# EAGLE schematic pcbremote (EAGLE 9.6.2)
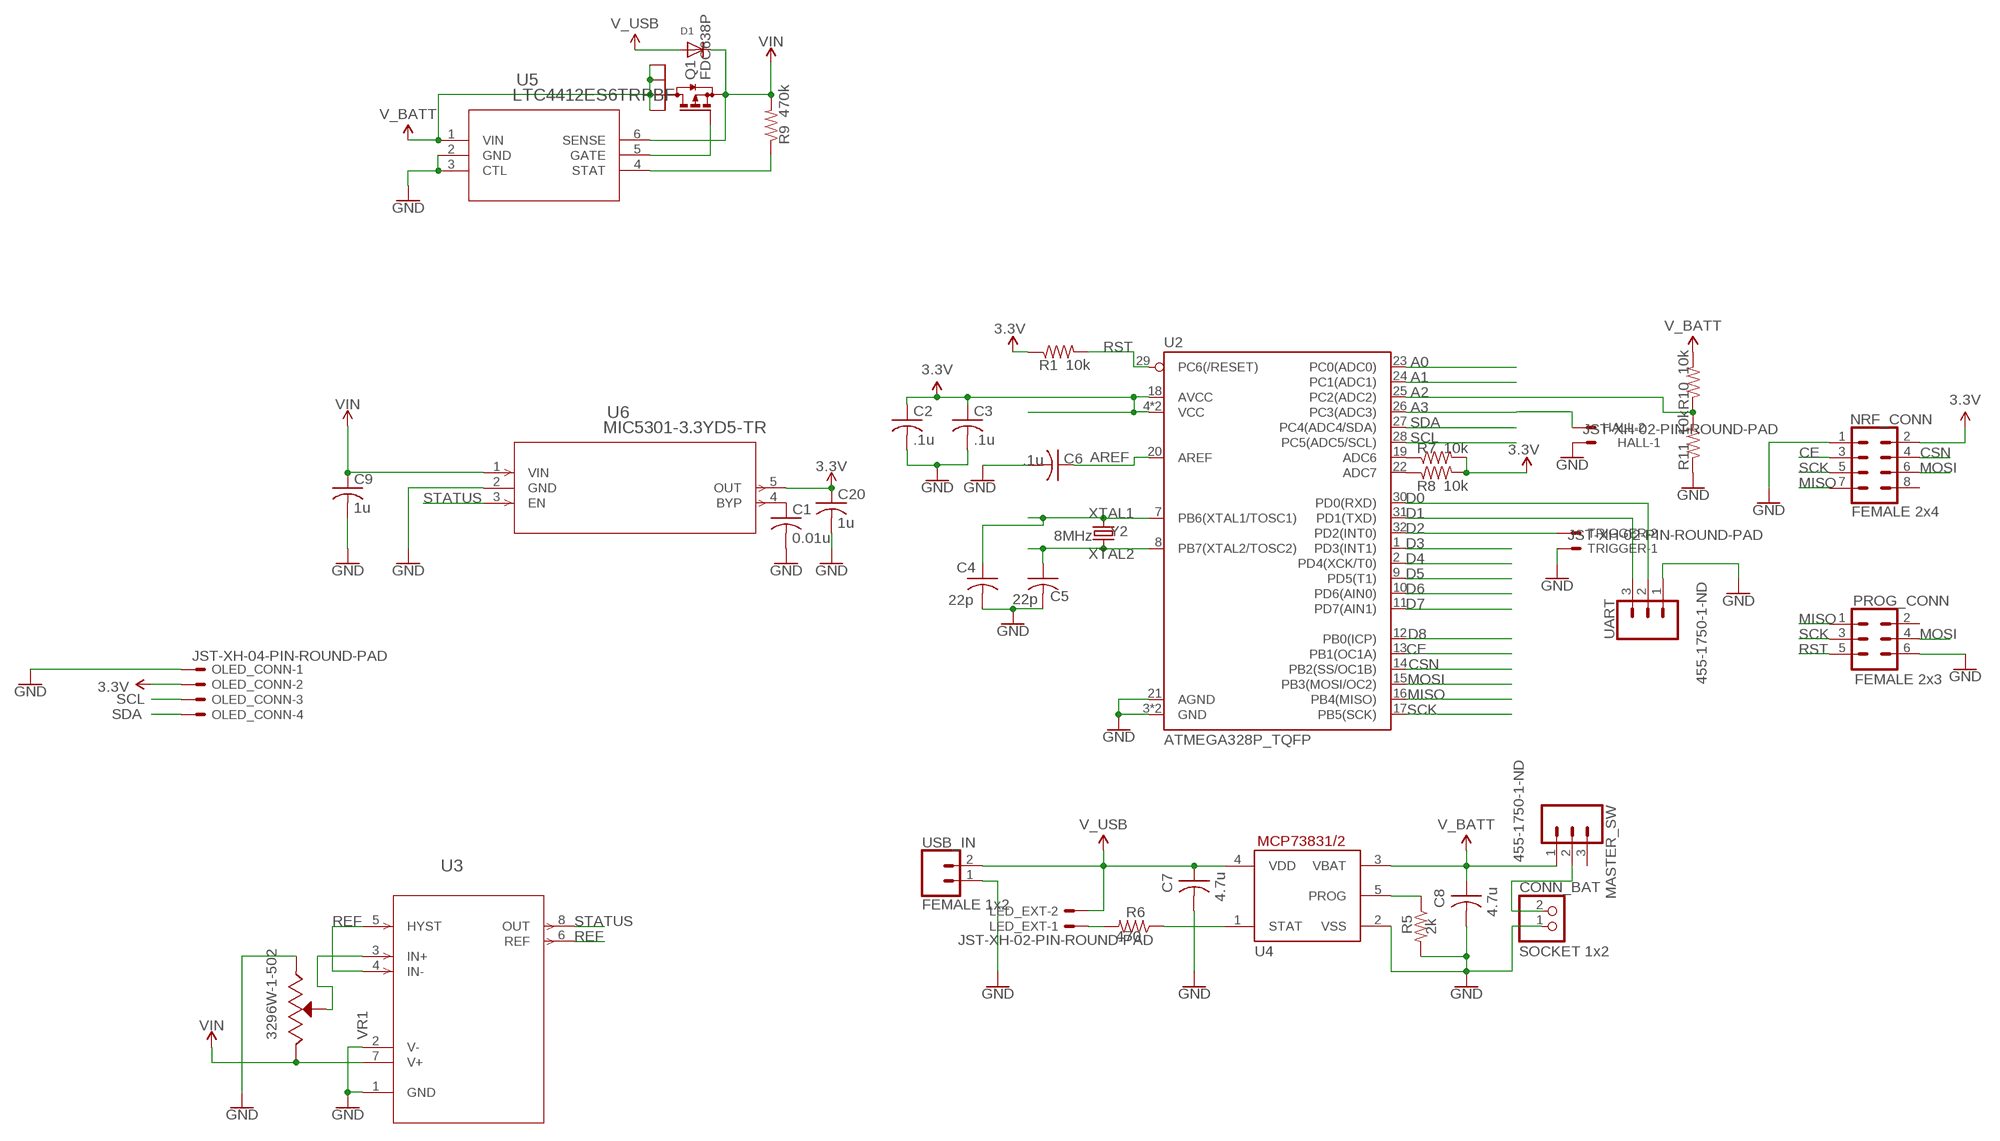
[diagram p0: schematic, sheet 1]

## Parts
C1  0.01u  C-USC0805  [C0805]
C2  .1u  C-USC0805  [C0805]
C3  .1u  C-USC0805  [C0805]
C4  22p  C-USC0805  [C0805]
C5  22p  C-USC0805  [C0805]
C6  .1u  C-USC0805  [C0805]
C7  4.7u  C-USC0805  [C0805]
C8  4.7u  C-USC0805  [C0805]
C9  1u  C-USC0805  [C0805]
C20  1u  C-USC0805  [C0805]
CONN_BAT  SOCKET 1x2  JST_2PIN-THM  [JST-PH-2-THM]
D1  DIODESOD-123  [SOD-123]
HALL  JST-XH-02-PIN-ROUND-PAD  [JST-XH-02-PACKAGE-ROUND-PAD]
LED_EXT  JST-XH-02-PIN-ROUND-PAD  [JST-XH-02-PACKAGE-ROUND-PAD]
MASTER_SW  455-1750-1-ND  CONN_03  [1X03]
NRF_CONN  FEMALE 2x4  CONN_04X2  [2X4]
OLED_CONN  JST-XH-04-PIN-ROUND-PAD  [JST-XH-04-PACKAGE-ROUND-PAD]
PROG_CONN  FEMALE 2x3  CONN_03X2FEMALE  [2X3]
Q1  FDC638P  [SSOT-6]
R1  10k  R-US_R0805  [R0805]
R5  2k  R-US_R0805  [R0805]
R6  470  R-US_R0805  [R0805]
R7  10k  R-US_R0805  [R0805]
R8  10k  R-US_R0805  [R0805]
R9  470k  R-US_R0805  [R0805]
R10  10k  R-US_R0805  [R0805]
R11  10k  R-US_R0805  [R0805]
TRIGGER  JST-XH-02-PIN-ROUND-PAD  [JST-XH-02-PACKAGE-ROUND-PAD]
U2  ATMEGA328P_TQFP  [TQFP32-08]
U3  LTC1540CS8PBF  [SO-8_S_LIT]
U4  MCP73831/OT  [SOT23-5L]
U5  LTC4412ES6TRPBF  [TSOT-23_S6_LIT]
U6  MIC5301-3.3YD5-TR  [TSOT-23-5_D5_MCH]
UART  455-1750-1-ND  CONN_03  [1X03]
USB_IN  FEMALE 1x2  CONN_02  [1X02]
VR1  3296W-1-502  [TRIM_3296W-1-502]
Y2  8MHz  CRYSTAL-8MHZSMD-5X3.2  [CRYSTAL-SMD-5X3.2-4PAD]

## Nets
3.3V: C2.1 C3.1 C20.1 NRF_CONN.2 OLED_CONN.2 R1.1 R7.2 R8.2 U2.4(VCC) U2.6(VCC) U2.18(AVCC) U6.5(OUT)
A0: U2.23(PC0(ADC0))
A1: U2.24(PC1(ADC1))
A2: R10.1 R11.2 U2.25(PC2(ADC2))
A3: HALL.2 U2.26(PC3(ADC3))
AREF: C6.1 U2.20(AREF)
CE: NRF_CONN.3 U2.13(PB1(OC1A))
CSN: NRF_CONN.4 U2.14(PB2(SS/OC1B))
D0: U2.30(PD0(RXD)) UART.2
D1: U2.31(PD1(TXD)) UART.3
D2: TRIGGER.2 U2.32(PD2(INT0))
D3: U2.1(PD3(INT1))
D4: U2.2(PD4(XCK/T0))
D5: U2.9(PD5(T1))
D6: U2.10(PD6(AIN0))
D7: U2.11(PD7(AIN1))
D8: U2.12(PB0(ICP))
GND: C1.2 C2.2 C3.2 C4.2 C5.2 C6.2 C7.2 C8.2 C9.2 C20.2 CONN_BAT.1 HALL.1 NRF_CONN.1 OLED_CONN.1 PROG_CONN.6 R5.2 R11.1 TRIGGER.1 U2.3(GND) U2.5(GND) U2.21(AGND) U3.1(GND) U3.2(V-) U4.2(VSS) U5.2(GND) U5.3(CTL) U6.2(GND) UART.1 USB_IN.1 VR1.3(CW)
MISO: NRF_CONN.7 PROG_CONN.1 U2.16(PB4(MISO))
MOSI: NRF_CONN.6 PROG_CONN.4 U2.15(PB3(MOSI/OC2))
N$1: U3.3(IN+) VR1.2(WIPER)
N$3: R5.1 U4.5(PROG)
N$4: R6.1 U4.1(STAT)
N$5: LED_EXT.1 R6.2
N$6: R7.1 U2.19(ADC6)
N$7: R8.1 U2.22(ADC7)
N$8: C1.1 U6.4(BYP)
N$9: Q1.3(G) U5.5(GATE)
N$10: CONN_BAT.2 MASTER_SW.2
N$13: R9.1 U5.4(STAT)
REF: U3.4(IN-) U3.5(HYST) U3.6(REF)
RST: PROG_CONN.5 R1.2 U2.29(PC6(/RESET))
SCK: NRF_CONN.5 PROG_CONN.3 U2.17(PB5(SCK))
SCL: OLED_CONN.3 U2.28(PC5(ADC5/SCL))
SDA: OLED_CONN.4 U2.27(PC4(ADC4/SDA))
STATUS: U3.8(OUT) U6.3(EN)
V_BATT: C8.1 MASTER_SW.1 Q1.1(D4) Q1.2(D1) Q1.5(D2) Q1.6(D3) R10.2 U4.3(VBAT) U5.1(VIN)
V_USB: C7.1 D1.A LED_EXT.2 U4.4(VDD) USB_IN.2
VIN: C9.1 D1.C Q1.4(S) R9.2 U3.7(V+) U5.6(SENSE) U6.1(VIN) VR1.1(CCW)
XTAL1: C4.1 U2.7(PB6(XTAL1/TOSC1)) Y2.1
XTAL2: C5.1 U2.8(PB7(XTAL2/TOSC2)) Y2.3
Unconnected: MASTER_SW.3 NRF_CONN.8 PROG_CONN.2

## Library data of the parts
C1-C9 C20 = rcl:C-US: CAPACITOR, American symbol; SPICEPREFIX: C
CONN_BAT = adafruit:JST_2PIN: JST 2-Pin Connectors of various flavors SMT-RA (S2B-PH-SM4) 4UConnector #17311 SMT (B2B-PH-SM4) THM-RA (S2B-PH) THM (B2B-PH)
D1 = adafruit:DIODE: Diode SMADIODE - SMA Surface Mount Package 20V 1A Schottky Diode Digikey: 641-1014-6-ND DO-1N4148 - Through Hole Small Current Diode SOD-123 20V 1 A (.5mV Vf) Schottky Diode - Digikey: MBRX120TPMSCT-ND SOD-323 10V 570mA (.38mV Vf, 3ns) Schottky Diode - Digikey: ZLLS410CT-ND SOD-523 30V 30mA Schottky Diode (RB751S-40TE61) - Digikey: RB751S-40TE61CT-ND SOT23-R/W - SOT23 Package (R = Solder Paste/Reflow Ovens, W = Hand-Soldering) BAT54Film 40V 300mA - Digikey: 497-7162-1-ND
HALL LED_EXT TRIGGER = Rembrandt Electronics - JST XH Connectors v1-0:JST-XH-02-PIN: JST XH Connector 2 Pin Wire to board connector. Pitch: 2,54 mm, (0.100") Number of pins: 2 Created by Rembrandt Electronics www.rembrandtelectronics.com
MASTER_SW UART = SparkFun-Connectors:CONN_03: Multi connection point. Often used as Generic Header-pin footprint for 0.1 inch spaced/style header connections On any of the 0.1 inch spaced packages, you can populate with these: Break Away Headers - Straight <https://www.sparkfun.com/products/116> (PRT-00116) Break Away Male Headers - Right Angle <https://www.sparkfun.com/products/553> (PRT-00553) Female Headers <https://www.sparkfun.com/products/115> (PRT-00115) Break Away Headers - Machine Pin <https://www.sparkfun.com/products/117> (PRT-00117) Break Away Female Headers - Swiss Machine Pin <https://www.sparkfun.com/products/743> (PRT-00743) Stackable Header - 3 Pin (Female, 0.1") <https://www.sparkfun.com/products/13875> (PRT-13875) For SCREWTERMINALS and SPRING TERMINALS visit here: Screw Terimnals on SparkFun.com <https://www.sparkfun.com/search/results?term=Screw+Terminals> (5mm/3.5mm/2.54mm spacing) This device is also useful as a general connection point to wire up your design to another part of your project. Our various solder wires solder well into these plated through hole pads. Hook-Up Wire - Assortment (Stranded, 22 AWG) <https://www.sparkfun.com/products/11375> (PRT-11375) Hook-Up Wire - Assortment (Solid Core, 22 AWG) <https://www.sparkfun.com/products/11367> (PRT-11367) View the entire wire category on our website here <https://www.sparkfun.com/categories/141> Special notes: Molex polarized connector foot print use with SKU : PRT-08232 with associated crimp pins and housings.; PROD_ID: XXX-00000
NRF_CONN = SparkFun-Connectors:CONN_04X2: Multi connection point. Often used as Generic Header-pin footprint for 0.1 inch spaced/style header connections On any of the 0.1 inch spaced packages, you can populate with these: Break Away Headers - Straight <https://www.sparkfun.com/products/116> (PRT-00116) Break Away Male Headers - Right Angle <https://www.sparkfun.com/products/553> (PRT-00553) Female Headers <https://www.sparkfun.com/products/115> (PRT-00115) Break Away Headers - Machine Pin <https://www.sparkfun.com/products/117> (PRT-00117) Break Away Female Headers - Swiss Machine Pin <https://www.sparkfun.com/products/743> (PRT-00743)
OLED_CONN = Rembrandt Electronics - JST XH Connectors v1-0:JST-XH-04-PIN: JST XH Connector 2 Pin Wire to board connector. Pitch: 2,54 mm, (0.100") Number of pins: 4 Created by Rembrandt Electronics www.rembrandtelectronics.com
PROG_CONN = SparkFun-Connectors:CONN_03X2: Multi connection point. Often used as Generic Header-pin footprint for 0.1 inch spaced/style header connections You can populate with any combo of single row headers, but if you'd like an exact match, check these: Header - 2x3 (Male, 0.1") <https://www.sparkfun.com/products/12807> (PRT-12807) Header - 2x3 (Female, 0.1") <https://www.sparkfun.com/products/13010> (PRT-13010) 2x3 Pin Shrouded Header <https://www.sparkfun.com/products/10877> (PRT-10877) On any of the 0.1 inch spaced packages, you can populate with these: Break Away Headers - Straight <https://www.sparkfun.com/products/116> (PRT-00116) Break Away Male Headers - Right Angle <https://www.sparkfun.com/products/553> (PRT-00553) Female Headers <https://www.sparkfun.com/products/115> (PRT-00115) Break Away Headers - Machine Pin <https://www.sparkfun.com/products/117> (PRT-00117) Break Away Female Headers - Swiss Machine Pin <https://www.sparkfun.com/products/743> (PRT-00743) Special note: the shrouded connector mates well with our 3x2 ribbon cables: Ribbon Crimp Connector - 6-pin (2x3, Female) <https://www.sparkfun.com/products/10651> (PRT-10651) Ribbon Cable - 6 wire (15ft) <https://www.sparkfun.com/products/10646> (PRT-10646); PROD_ID: CONN-11566
Q1 = FDC638P:FDC638P; DESCRIPTION: P-Channel 20V 4.5A (Ta) 1.6W (Ta) Surface Mount SuperSOT™-6; DIGI-KEY_PART_NUMBER: FDC638PCT-ND; MF: ON Semiconductor; MP: FDC638P; PACKAGE: TSOT-23-6 ON Semiconductor
R1 R5-R11 = rcl:R-US_: RESISTOR, American symbol; SPICEPREFIX: R
U2 = SparkFun-IC-Microcontroller:ATMEGA328P_TQFP: Popular 328P in QFP Storefront component: ATmega328 - TQFP <https://www.sparkfun.com/products/13448> (COM-13448) Datasheet <http://www.sparkfun.com/datasheets/Components/SMD/ATMega328.pdf> SparkFun Products SparkFun RedBoard - Programmed with Arduino <https://www.sparkfun.com/products/12757> (DEV-12757) Arduino Pro Mini 328 - 5V/16MHz <https://www.sparkfun.com/products/11113> (DEV-11113) Arduino Pro Mini 328 - 3.3V/8MHz <https://www.sparkfun.com/products/11114> (DEV-11114) SparkFun OpenLog <https://www.sparkfun.com/products/13712> (DEV-13712) SparkFun MicroView - OLED Arduino Module <https://www.sparkfun.com/products/12923> (DEV-12923) SparkFun Digital Sandbox <https://www.sparkfun.com/products/12651> (DEV-12651) SparkFun PicoBoard <https://www.sparkfun.com/products/11888> (WIG-11888) Arduino Fio <https://www.sparkfun.com/products/10116> (DEV-10116) LilyPad Arduino 328 Main Board <https://www.sparkfun.com/products/13342> (DEV-13342) SparkFun RedStick <https://www.sparkfun.com/products/13741> (DEV-13741) LilyPad MP3 <https://www.sparkfun.com/products/11013> (DEV-11013) LilyPad Arduino SimpleSnap <https://www.sparkfun.com/products/10941> (DEV-10941) SparkFun Stepoko <https://www.sparkfun.com/products/13899> (ROB-13899) SparkFun Geiger Counter <https://www.sparkfun.com/products/11345> (SEN-11345) SparkFun EL Sequencer <https://www.sparkfun.com/products/12781> (COM-12781) Arduino Pro 328 - 5V/16MHz <https://www.sparkfun.com/products/10915> (DEV-10915) CryptoCape <https://www.sparkfun.com/products/12773> (DEV-12773) SparkFun IR Thermometer Evaluation Board - MLX90614 <https://www.sparkfun.com/products/10740> (SEN-10740) SparkFun RedBot Mainboard <https://www.sparkfun.com/products/12097> (ROB-12097) Arduino Pro 328 - 3.3V/8MHz <https://www.sparkfun.com/products/10914> (DEV-10914) SparkFun Block for Intel® Edison - Arduino <https://www.sparkfun.com/products/13036> (DEV-13036) SparkFun Simon Says - Surface Mount Soldering Kit <https://www.sparkfun.com/products/10935> (KIT-10935) SparkFun 7-Segment Serial Display - Red <https://www.sparkfun.com/products/11441> (COM-11441) SparkFun 7-Segment Serial Display - White <https://www.sparkfun.com/products/11629> (COM-11629) SparkFun 7-Segment Serial Display - Yellow <https://www.sparkfun.com/products/11443> (COM-11443) SparkFun 7-Segment Serial Display - Kelly Green <https://www.sparkfun.com/products/11440> (COM-11440) SparkFun 7-Segment Serial Display - Blue <https://www.sparkfun.com/products/11442> (COM-11442) SparkFun OpenSegment Serial Display - 20mm (Blue) <https://www.sparkfun.com/products/11647> (COM-11647) SparkFun OpenSegment Serial Display - 20mm (Green) <https://www.sparkfun.com/products/11646> (COM-11646) SparkFun OpenSegment Serial Display - 20mm (White) <https://www.sparkfun.com/products/11648> (COM-11648) SparkFun OpenSegment Serial Display - 20mm (Red) <https://www.sparkfun.com/products/11644> (COM-11644) SparkFun OpenSegment Serial Display - 20mm (Yellow) <https://www.sparkfun.com/products/11645> (COM-11645) SparkFun OpenSegment Shield <https://www.sparkfun.com/products/13190> (DEV-13190); PROD_ID: IC-09069
U3 = LTC_1450:LTC1540CS8PBF; BUILT_BY: EMA_UL_Team; MANUFACTURER_PART_NUMBER: ltc1540cs8#pbf; SOURCELIBRARY: LinearTech_2016_03_08; VENDOR: Linear Technology
U4 = adafruit:MCP73831: MCP73831/2 Miniature Single-Cell, Fully Integrated Li-Ion, Li-Polymer Charge Management Controllers. Nice and small simple lipoly charge controller, with adjustable current and status output (LED) http://www.ladyada.net/library/pcb/eaglelibrary.html
U5 = LTC4412:LTC4412ES6TRPBF; BUILT_BY: EMA_UL_Team; MANUFACTURER_PART_NUMBER: LTC4412ES6#TRPBF; SOURCELIBRARY: LinearTech_2016-05-13_1; VENDOR: Linear Technology
U6 = MIC5301:MIC5301-3.3YD5-TR; BUILT_BY: EMA_Jessica; COPYRIGHT: Copyright (C) 2018 Accelerated Designs. All rights reserved; MANUFACTURER_PART_NUMBER: MIC5301-3.3YD5-TR; SOURCELIBRARY: Microchip_2019-08-23_3; VENDOR: Microchip
USB_IN = SparkFun-Retired:CONN_02: Multi connection point. Often used as Generic Header-pin footprint for 0.1 inch spaced/style header connections On any of the 0.1 inch spaced packages, you can populate with these: Break Away Headers - Straight <https://www.sparkfun.com/products/116> (PRT-00116) Break Away Male Headers - Right Angle <https://www.sparkfun.com/products/553> (PRT-00553) Female Headers <https://www.sparkfun.com/products/115> (PRT-00115) Break Away Headers - Machine Pin <https://www.sparkfun.com/products/117> (PRT-00117) Break Away Female Headers - Swiss Machine Pin <https://www.sparkfun.com/products/743> (PRT-00743) For SCREWTERMINALS and SPRING TERMINALS visit here: Screw Terimnals on SparkFun.com <https://www.sparkfun.com/search/results?term=Screw+Terminals> (5mm/3.5mm/2.54mm spacing) This device is also useful as a general connection point to wire up your design to another part of your project. Our various solder wires solder well into these plated through hole pads. Hook-Up Wire - Assortment (Stranded, 22 AWG) <https://www.sparkfun.com/products/11375> (PRT-11375) Hook-Up Wire - Assortment (Solid Core, 22 AWG) <https://www.sparkfun.com/products/11367> (PRT-11367) View the entire wire category on our website here <https://www.sparkfun.com/categories/141> Special notes: Molex polarized connector foot print use with: PRT-08233 with associated crimp pins and housings. 2.54_SCREWTERM for use with PRT-10571. 3.5mm Screw Terminal footprints for PRT-08084 5mm Screw Terminal footprints for use with PRT-08432
VR1 = 3296W-1-502:3296W-1-502: Res Cermet Trimmer 500K Ohm 10% 0.5W 25(Elec)Turn 2.19mm (9.53 X 4.83 X 11.55mm) Pin Thru-Hole Tube; DESCRIPTION: 5 kOhms 0.5W, 1/2W PC Pins Through Hole Trimmer Potentiometer Cermet 25 Turn Top Adjustment; DIGI-KEY_PART_NUMBER: 3296W-502LF-ND; MF: Bourns; MP: 3296W-1-502; PACKAGE: SOT-23-5 Bourns; PURCHASE-URL: https://pricing.snapeda.com/search/part/3296W-1-502/?ref=eda
Y2 = SparkFun-Clocks:CRYSTAL-8MHZ: 8MHz Crystal Datasheet Example <http://www.futureelectronics.com/en/technologies/electromechanical/timing-devices/crystals/Pages/6008189-ABM3B-8.000MHZ-B2-T.aspx?IM=0> Frequency: 8MHz Frequency Tolerance: ±20ppm Load Capacitance: 18pF SparkFun Products: Pro Micro -3.3V/8MHz <https://www.sparkfun.com/products/12587> WAV Trigger <https://www.sparkfun.com/products/13660>; PROD_ID: XTAL-09431